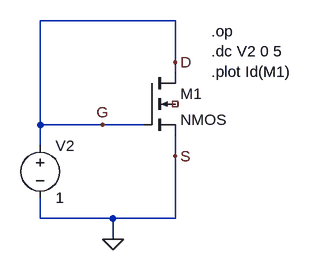
[diagram p0: schematic Draft2.asc]
Draft2.asc, the LTspice schematic file:
Version 4
SHEET 1 880 680
WIRE 336 144 128 144
WIRE 336 208 336 144
WIRE 336 224 336 208
WIRE 128 304 128 144
WIRE 224 304 128 304
WIRE 288 304 224 304
WIRE 128 336 128 304
WIRE 336 352 336 320
WIRE 128 448 128 416
WIRE 240 448 128 448
WIRE 336 448 336 352
WIRE 336 448 240 448
WIRE 240 480 240 448
FLAG 240 480 0
FLAG 224 304 G
FLAG 336 208 D
FLAG 336 352 S
SYMBOL voltage 128 320 R0
SYMATTR InstName V2
SYMATTR Value 1
SYMBOL nmos4 288 224 R0
SYMATTR InstName M1
SYMATTR Value2 l=0.18 w=10
TEXT 392 160 Left 2 !.op\n.dc V2 0 5\n.plot Id(M1)

The netlist it stands for:
* Draft2.asc
V2 D 0 1
M1 D D 0 NC_01 NMOS l=0.18 w=10
.model NMOS NMOS
.model PMOS PMOS
.lib standard.mos
.op
.dc V2 0 5
.plot Id(M1)
.backanno
.end